# EAGLE design Motherboard_v2 (EAGLE 6.2)
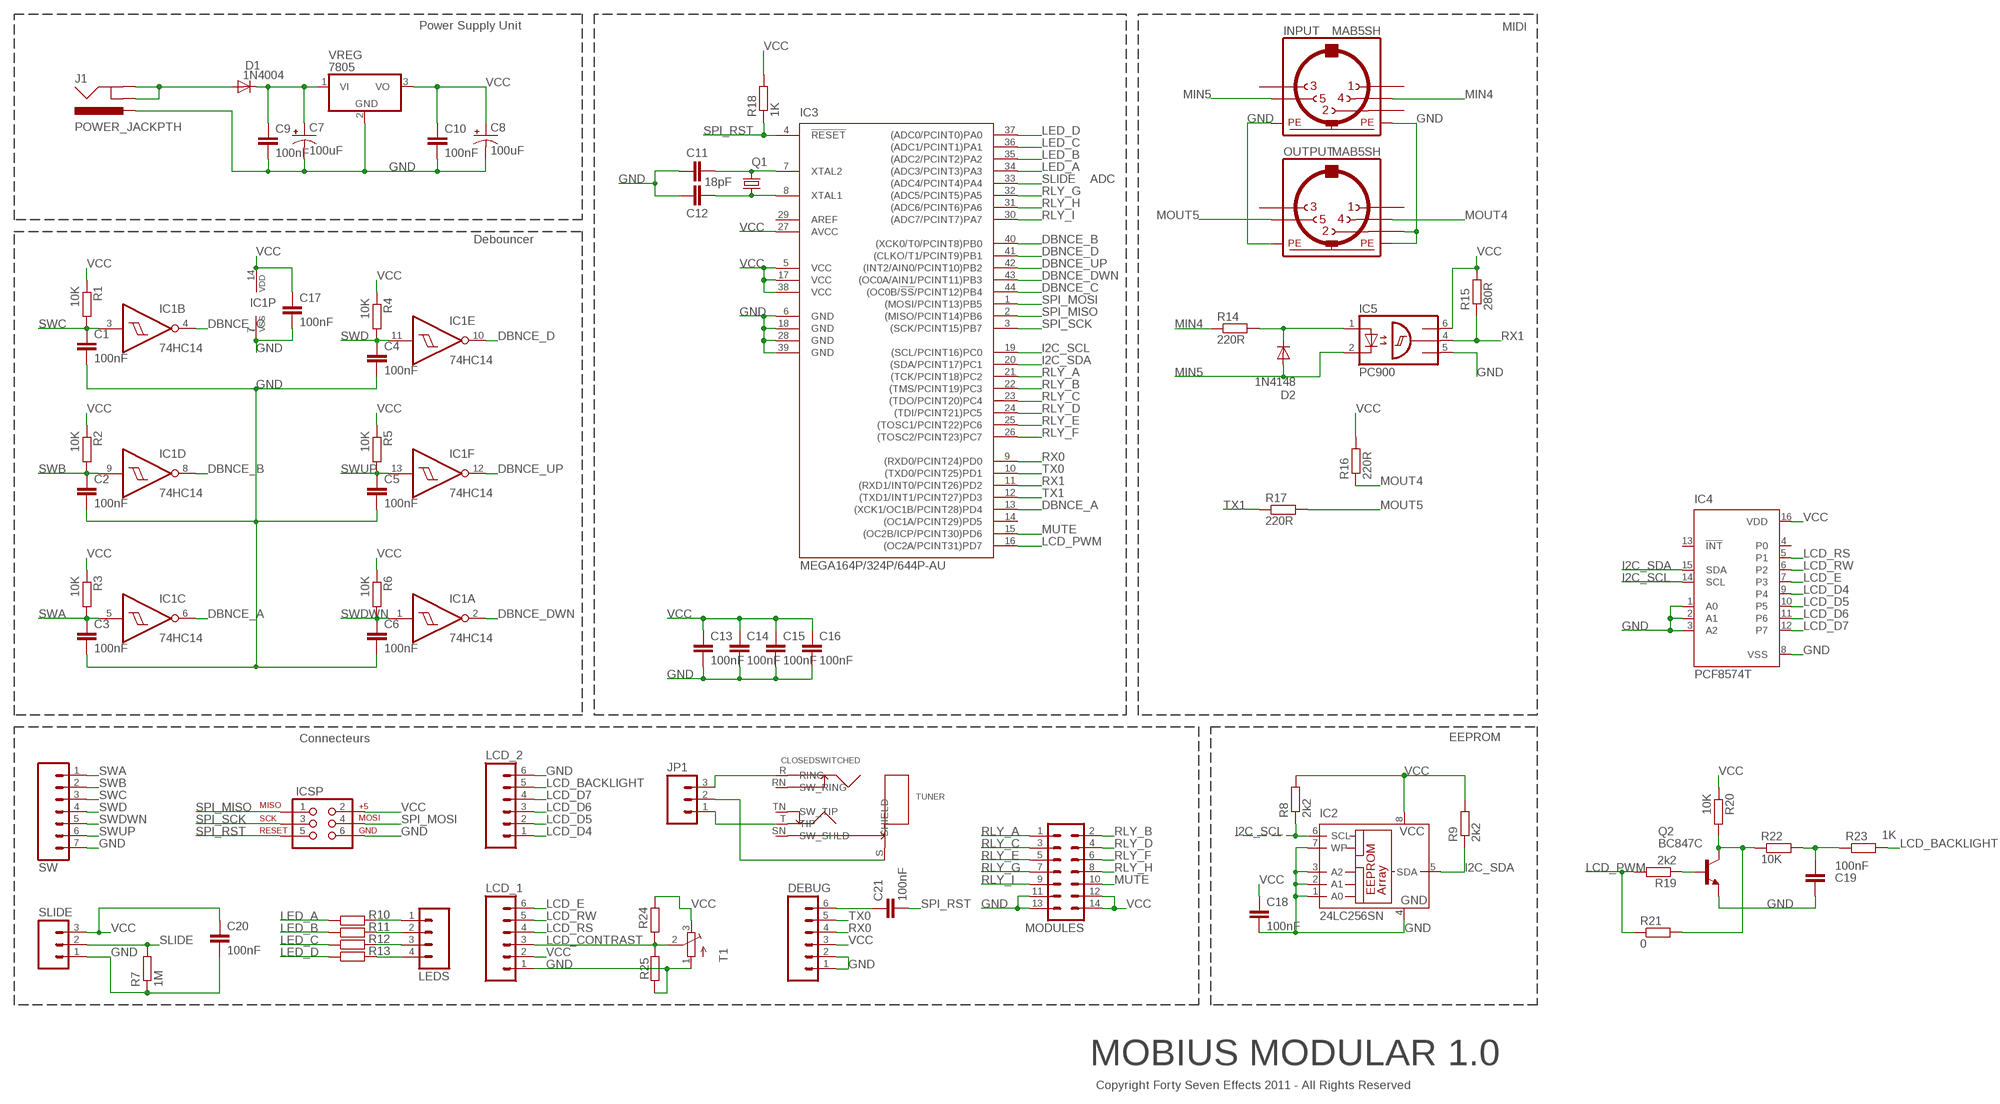
[diagram p0: schematic, sheet 1]

## Parts
C1  100nF  C-EUC0805K  [C0805K]
C2  100nF  C-EUC0805K  [C0805K]
C3  100nF  C-EUC0805K  [C0805K]
C4  100nF  C-EUC0805K  [C0805K]
C5  100nF  C-EUC0805K  [C0805K]
C6  100nF  C-EUC0805K  [C0805K]
C7  100uF  CPOL-USE2,5-6E  [E2,5-6E]
C8  100uF  CPOL-USE2,5-6E  [E2,5-6E]
C9  100nF  C-EUC0805K  [C0805K]
C10  100nF  C-EUC0805K  [C0805K]
C11  18pF  C-EUC0805K  [C0805K]
C12  18pF  C-EUC0805K  [C0805K]
C13  100nF  C-EUC0805K  [C0805K]
C14  100nF  C-EUC0805K  [C0805K]
C15  100nF  C-EUC0805K  [C0805K]
C16  100nF  C-EUC0805K  [C0805K]
C17  100nF  C-EUC0805K  [C0805K]
C18  100nF  C-EUC0805K  [C0805K]
C19  100nF  C-EUC0805K  [C0805K]
C20  100nF  C-EUC0805K  [C0805K]
C21  100nF  C-EUC0805K  [C0805K]
D1  1N4004  [DO41-10]
D2  1N4148  1N4148DO35-7  [DO35-7]
DEBUG  M06SIP  [1X06]
IC1  74HC14  40106D  [SO14]
IC2  24LC256SN  [SO-08]
IC3  MEGA164P/324P/644P-AU  [TQFP44]
IC4  PCF8574T  [SO16W]
IC5  PC900  OPI8013  [DIL06]
ICSP  AVR_SPI_PRG_6PTH  [2X3]
INPUT  MAB5SH  [MAB5SH]
J1  POWER_JACKPTH  [POWER_JACK_PTH]
JP1  M03POLAR  [MOLEX-1X3]
LCD_1  M06SIP  [1X06]
LCD_2  M06SIP  [1X06]
LEDS  M04PTH  [1X04]
MODULES  ML14  [ML14]
OUTPUT  MAB5SH  [MAB5SH]
Q1  16MHz  CRYSTAL5X3  [CRYSTAL-SMD-5X3]
Q2  BC847C  BC847CSMD  [SOT23]
R1  10K  R-EU_M0805  [M0805]
R2  10K  R-EU_M0805  [M0805]
R3  10K  R-EU_M0805  [M0805]
R4  10K  R-EU_M0805  [M0805]
R5  10K  R-EU_M0805  [M0805]
R6  10K  R-EU_M0805  [M0805]
R7  1M  R-EU_M0805  [M0805]
R8  2k2  R-EU_M0805  [M0805]
R9  2k2  R-EU_M0805  [M0805]
R10  1k  R-EU_M0805  [M0805]
R11  1K  R-EU_M0805  [M0805]
R12  1k  R-EU_M0805  [M0805]
R13  1k  R-EU_M0805  [M0805]
R14  220R  R-EU_M0805  [M0805]
R15  280R  R-EU_M0805  [M0805]
R16  220R  R-EU_M0805  [M0805]
R17  220R  R-EU_M0805  [M0805]
R18  1K  R-EU_M0805  [M0805]
R19  2k2  R-EU_M0805  [M0805]
R20  10K  R-EU_M0805  [M0805]
R21  0  R-EU_M0805  [M0805]
R22  10K  R-EU_M0805  [M0805]
R23  1K  R-EU_M0805  [M0805]
R24  1k  R-EU_M0805  [M0805]
R25  1k  R-EU_M0805  [M0805]
SLIDE  M03PTH  [1X03]
SW  M07  [1X07]
T1  TRIMPOTTC33X  [TC33X]
TUNER  CLOSEDSWITCHED  [NMJ6HFD2]
VREG  7805  7805TV  [TO220V]

## Nets
DBNCE_A: IC1.6(C:O) IC3.13((XCK1/OC1B/PCINT28)PD4)
DBNCE_B: IC1.8(D:O) IC3.40((XCK0/T0/PCINT8)PB0)
DBNCE_C: IC1.4(B:O) IC3.44((OC0B/!SS!/PCINT12)PB4)
DBNCE_D: IC1.10(E:O) IC3.41((CLKO/T1/PCINT9)PB1)
DBNCE_DWN: IC1.2(A:O) IC3.43((OC0A/AIN1/PCINT11)PB3)
DBNCE_UP: IC1.12(F:O) IC3.42((INT2/AIN0/PCINT10)PB2)
GND: C1.2 C2.2 C3.2 C4.2 C5.2 C6.2 C7.- C8.- C9.2 C10.2 C11.1 C12.1 C13.2 C14.2 C15.2 C16.2 C17.2 C18.2 C19.1 C20.2 DEBUG.1 DEBUG.2 IC1.7(P:VSS) IC2.1(A0) IC2.2(A1) IC2.3(A2) IC2.4(GND) IC2.7(WP) IC3.6(GND) IC3.18(GND) IC3.28(GND) IC3.39(GND) IC4.1(A0) IC4.2(A1) IC4.3(A2) IC4.8(VSS) IC5.5(GND) ICSP.6 INPUT.PE INPUT.PE@(PE) J1.PWR LCD_1.1 LCD_2.6 MODULES.11 MODULES.13 OUTPUT.2 OUTPUT.PE OUTPUT.PE@(PE) Q2.2(E) R7.1 R25.1 SLIDE.1 SW.7 T1.1(A) VREG.2(GND)
I2C_SCL: IC2.6(SCL) IC3.19((SCL/PCINT16)PC0) IC4.14(SCL) R8.1
I2C_SDA: IC2.5(SDA) IC3.20((SDA/PCINT17)PC1) IC4.15(SDA) R9.1
LCD_BACKLIGHT: LCD_2.5 R23.2
LCD_CONTRAST: LCD_1.3 R24.1 R25.2 T1.2(S)
LCD_D4: IC4.9(P4) LCD_2.1
LCD_D5: IC4.10(P5) LCD_2.2
LCD_D6: IC4.11(P6) LCD_2.3
LCD_D7: IC4.12(P7) LCD_2.4
LCD_E: IC4.7(P3) LCD_1.6
LCD_PWM: IC3.16((OC2A/PCINT31)PD7) R19.2 R21.1
LCD_RS: IC4.5(P1) LCD_1.4
LCD_RW: IC4.6(P2) LCD_1.5
LED_A: IC3.34((ADC3/PCINT3)PA3) R10.1
LED_B: IC3.35((ADC2/PCINT2)PA2) R11.1
LED_C: IC3.36((ADC1/PCINT1)PA1) R12.1
LED_D: IC3.37((ADC0/PCINT0)PA0) R13.1
MIN4: INPUT.4 R14.1
MIN5: D2.A IC5.2(C) INPUT.5
MOUT4: OUTPUT.4 R16.1
MOUT5: OUTPUT.5 R17.2
MUTE: IC3.15((OC2B/ICP/PCINT30)PD6) MODULES.10
N$1: C7.+ C9.1 D1.C VREG.1(VI)
N$2: LEDS.1 R10.2
N$3: LEDS.2 R11.2
N$4: D1.A J1.GND J1.GNDBREAK
N$5: LEDS.3 R12.2
N$6: D2.C IC5.1(A) R14.2
N$7: LEDS.4 R13.2
N$8: C11.2 IC3.7(XTAL2) Q1.3
N$9: C12.2 IC3.8(XTAL1) Q1.1
N$10: JP1.1 TUNER.T(TIP)
N$11: JP1.3 TUNER.R(RING)
N$12: JP1.2 TUNER.S(SHIELD)
N$13: Q2.1(B) R19.1
N$14: Q2.3(C) R20.2 R21.2 R22.1
N$15: C19.2 R22.2 R23.1
N$16: C21.1 DEBUG.6
RLY_A: IC3.21((TCK/PCINT18)PC2) MODULES.1
RLY_B: IC3.22((TMS/PCINT19)PC3) MODULES.2
RLY_C: IC3.23((TDO/PCINT20)PC4) MODULES.3
RLY_D: IC3.24((TDI/PCINT21)PC5) MODULES.4
RLY_E: IC3.25((TOSC1/PCINT22)PC6) MODULES.5
RLY_F: IC3.26((TOSC2/PCINT23)PC7) MODULES.6
RLY_G: IC3.32((ADC5/PCINT5)PA5) MODULES.7
RLY_H: IC3.31((ADC6/PCINT6)PA6) MODULES.8
RLY_I: IC3.30((ADC7/PCINT7)PA7) MODULES.9
RX0: DEBUG.4 IC3.9((RXD0/PCINT24)PD0)
RX1: IC3.11((RXD1/INT0/PCINT26)PD2) IC5.4(OUT) R15.1
SLIDE: IC3.33((ADC4/PCINT4)PA4) R7.2 SLIDE.2
SPI_MISO: IC3.2((MISO/PCINT14)PB6) ICSP.1
SPI_MOSI: IC3.1((MOSI/PCINT13)PB5) ICSP.4
SPI_RST: C21.2 IC3.4(!RESET) ICSP.5 R18.1
SPI_SCK: IC3.3((SCK/PCINT15)PB7) ICSP.3
SWA: C3.1 IC1.5(C:I) R3.2 SW.1
SWB: C2.1 IC1.9(D:I) R2.2 SW.2
SWC: C1.1 IC1.3(B:I) R1.2 SW.3
SWD: C4.1 IC1.11(E:I) R4.2 SW.4
SWDWN: C6.1 IC1.1(A:I) R6.2 SW.5
SWUP: C5.1 IC1.13(F:I) R5.2 SW.6
TX0: DEBUG.5 IC3.10((TXD0/PCINT25)PD1)
TX1: IC3.12((TXD1/INT1/PCINT27)PD3) R17.1
VCC: C8.+ C10.1 C13.1 C14.1 C15.1 C16.1 C17.1 C18.1 C20.1 DEBUG.3 IC1.14(P:VDD) IC2.8(VCC) IC3.5(VCC) IC3.17(VCC) IC3.27(AVCC) IC3.38(VCC) IC4.16(VDD) IC5.6(VCC) ICSP.2 LCD_1.2 MODULES.12 MODULES.14 R1.1 R2.1 R3.1 R4.1 R5.1 R6.1 R8.2 R9.2 R15.2 R16.2 R18.2 R20.1 R24.2 SLIDE.3 T1.3(E) VREG.3(VO)
Unconnected: IC3.14((OC1A/PCINT29)PD5) IC4.4(P0) IC4.13(!INT) INPUT.1 INPUT.2 INPUT.3 OUTPUT.1 OUTPUT.3 TUNER.RN(SW_RING) TUNER.SN(SW_SHLD) TUNER.TN(SW_TIP)

## Notes on the sheet
- Power Supply Unit | MIDI
- ADC
- Debouncer
- Connecteurs | EEPROM
- MOBIUS MODULAR 1.0
- Copyright Forty Seven Effects 2011 - All Rights Reserved

## Power pins joined to a net without a drawn wire
AREF: IC3.29(AREF)

## Library data of the parts
C1-C6 C9-C21 = rcl:C-EU: CAPACITOR, European symbol
C7 C8 = rcl:CPOL-US: POLARIZED CAPACITOR, American symbol
D1 = diode:1N4004: DIODE general purpose rectifier, 1 A
D2 = diode:1N4148: DIODE high speed (Philips)
DEBUG LCD_1 LCD_2 = SparkFun:M06: Header 6 Standard 6-pin 0.1" header. Use with straight break away headers (SKU : PRT-00116), right angle break away headers (PRT-00553), swiss pins (PRT-00743), machine pins (PRT-00117), and female headers (PRT-00115). Molex polarized connector foot print use with SKU : PRT-08094 with associated crimp pins and housings. NOTES ON THE VARIANTS LOCK and LOCK_LONGPADS... This footprint was designed to help hold the alignment of a through-hole component (i.e. 6-pin header) while soldering it into place. You may notice that each hole has been shifted either up or down by 0.005 of an inch from it's more standard position (which is a perfectly straight line). This slight alteration caused the pins (the squares in the middle) to touch the edges of the holes. Because they are alternating, it causes a "brace" to hold the component in place. 0.005 has proven to be the perfect amount of "off-center" position when using our standard breakaway headers. Although looks a little odd when you look at the bare footprint, once you have a header in there, the alteration is very hard to notice. Also, if you push a header all the way into place, it is covered up entirely on the bottom side. This idea of altering the position of holes to aid alignment will be further integrated into the Sparkfun Library for other footprints. It can help hold any component with 3 or more connection pins.
IC1 = 40xx:40106: Hex SCHMITT TRIGGER
IC2 = microchip:24*: Serial EEPROM I2C
IC3 = avr-5:MEGA164P/324P/644P-AU
IC4 = micro-philips:PCF8574: I2C-Bus Remote 8-bit I/O expander http://www.semiconductors.philips.com/acrobat_download/datasheets/PCF8574_4.pdf; MPN: PCF8574T/3,512; OC_FARNELL: 1201255; OC_NEWARK: 70R6870
IC5 = optocoupler:OPI8013: OPTO COUPLER
ICSP = SparkFun:AVR_SPI_PRG_6: AVR ISP 6 Pin This is the reduced ISP connector for AVR programming. Common on Arduino. This footprint will take up less PCB space and can be used with a 10-pin to 6-pin adapter such as SKU: BOB-08508
INPUT OUTPUT = con-hirschmann:MAB5SH: Female CONNECTOR 5 pins 90 deg. with shield, horizontal (DIN 41524); OC_FARNELL: 809883; OC_NEWARK: unknown
J1 = SparkFun:POWER_JACK: Power Jack This is the standard 5.5mm barrel jack for power. The PTH is the most common, proven, reliable, footprint. All others are experimental. The Slot footprint only works if the mill layer is transmitted to the PCB fab house so be warned. Spark Fun Electronics SKU : PRT-00119. Mating wall wart : TOL-00298 (and others)
JP1 SLIDE = SparkFun:M03: Header 3 Standard 3-pin 0.1" header. Use with straight break away headers (SKU : PRT-00116), right angle break away headers (PRT-00553), swiss pins (PRT-00743), machine pins (PRT-00117), and female headers (PRT-00115). Molex polarized connector foot print use with SKU : PRT-08232 with associated crimp pins and housings.
LEDS = SparkFun:M04: Header 4 Standard 4-pin 0.1" header. Use with straight break away headers (SKU : PRT-00116), right angle break away headers (PRT-00553), swiss pins (PRT-00743), machine pins (PRT-00117), and female headers (PRT-00115). Molex polarized connector foot print use with SKU : PRT-08231 with associated crimp pins and housings.
MODULES = con-harting-ml:ML14: HARTING
Q1 = SparkFun:CRYSTAL: Crystals Various standard crystals. Proven footprints. Spark Fun Electronics SKU : COM-00534
Q2 = transistor-npn:BC847*: NPN Transistor
R1-R25 = rcl:R-EU_: RESISTOR, European symbol
SW = SparkFun:M07: Header 7 Standard 7-pin 0.1" header. Use with straight break away headers (SKU : PRT-00116), right angle break away headers (PRT-00553), swiss pins (PRT-00743), machine pins (PRT-00117), and female headers (PRT-00115). NOTES ON THE VARIANTS LOCK and LOCK_LONGPADS... This footprint was designed to help hold the alignment of a through-hole component (i.e. 7-pin header) while soldering it into place. You may notice that each hole has been shifted either up or down by 0.005 of an inch from it's more standard position (which is usually a perfectly straight line). This slight alteration caused the pins (the squares in the middle) to touch the edges of the holes. Because they are alternating, it causes a "brace" to hold the header in place. 0.005 has proven to be the perfect amount of "off-center" position when using our standard breakaway headers. Although looks a little odd when you look at the bare footprint, once you have a header in there, the alteration is very hard to notice. Also, if you push a header all the way into place, it is covered up entirely on the bottom side. This idea of altering the position of holes to aid alignment will be further integrated into the Sparkfun Library for other footprints. It can help hold any component with 3 or more connection pins.
T1 = adafruit:TRIMPOT: SMT trimmer potentiometer part number TC33X http://www.ladyada.net/library/eagle
TUNER = NeutrikJack:CLOSEDSWITCHED
VREG = linear:78*: Positive VOLTAGE REGULATOR Source: http://cache.national.com/ds/LM/LM78L05.pdf http://www.fairchildsemi.com/ds/LM/LM7805.pdf

## Board
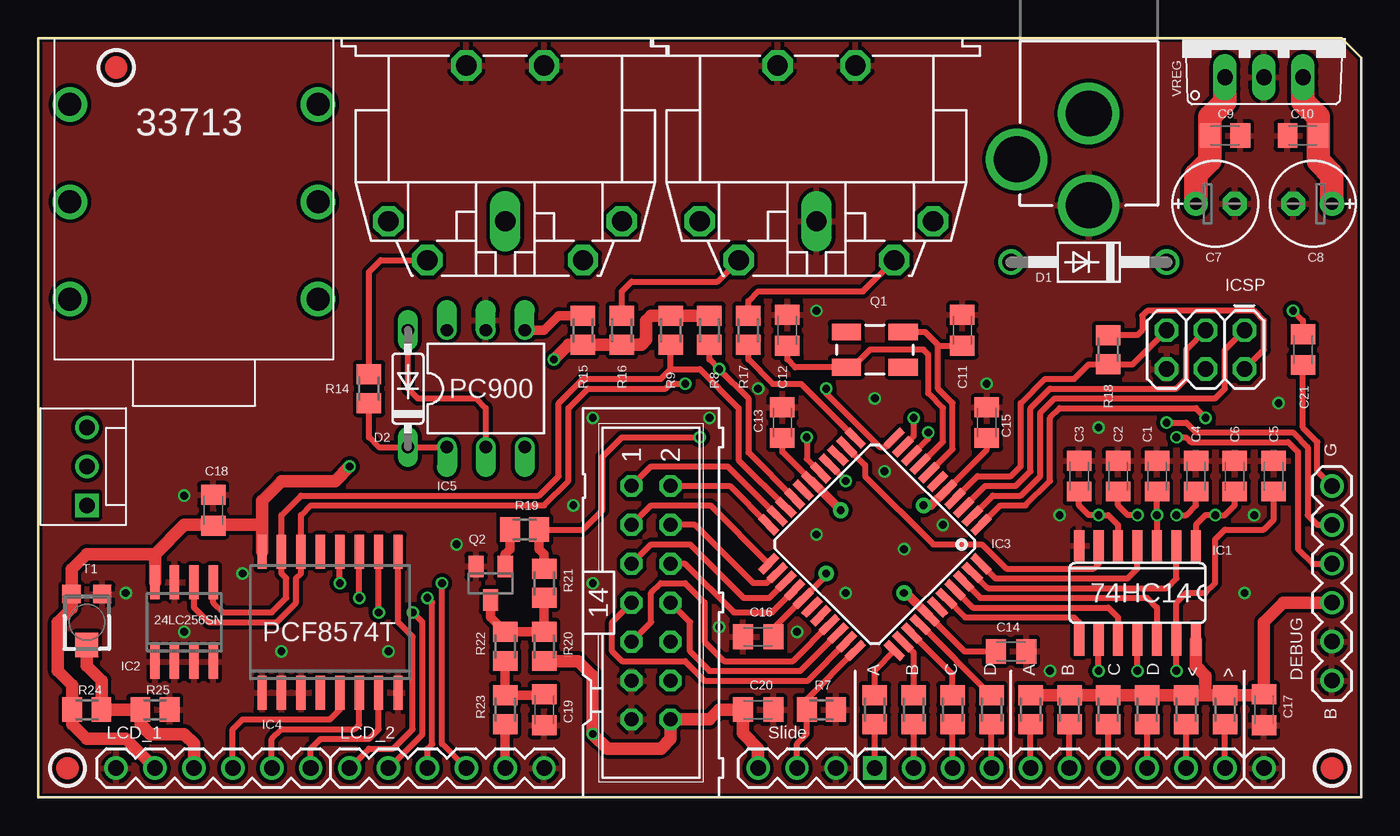
[diagram p1: board, top side]
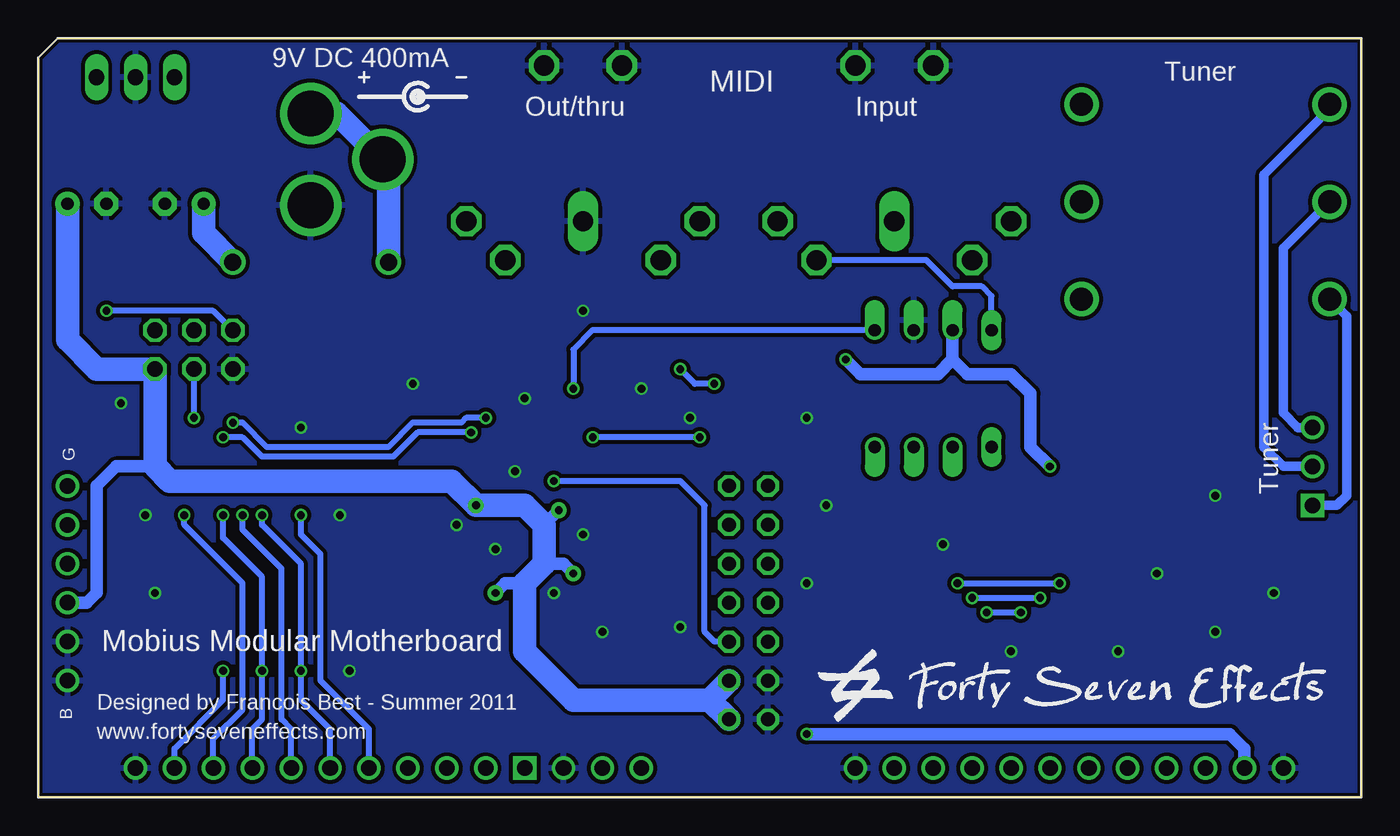
[diagram p2: board, bottom side, seen from below]

Size 86.36 x 49.53 mm. Coordinates in mm from the lower left corner, seen from the top.
Outline: 86.36,48.26 86.36,0 0,0 0,49.53 85.09,49.53 86.36,48.26
Copper layers (1*16): Top 0.035mm / dielectric 1.5mm / Bottom 0.035mm
Design rules: minimum track width 8mil, minimum drill 20mil, track to track 8mil, track to pad 8mil, pad to pad 8mil, via to via 8mil, smd to smd 0mil, copper to edge 10mil, drill to drill 10mil, minimum pad ring 10mil, minimum via ring 6mil, stop-mask expansion 2mil, vias tented up to drill 100mil, thermal gap 10mil

### Footprints (pad centres in the part's own frame; a part is rotated, then mirrored left to right if it is on the bottom)
C0805K = smd 1.3 x 1.6: 1 -1,0; 2 1,0
E2,5-6E = drill 0.813 pad 1.575: + -1.27,0 | drill 0.813 pad 1.575 octagon: - 1.27,0
DO41-10 = drill 1.118: A 5.08,0; C -5.08,0
DO35-7 = drill 0.813 long: A 3.81,0; C -3.81,0
1X06 = drill 1.016: 1 0,0; 2 2.54,0; 3 5.08,0; 4 7.62,0; 5 10.16,0; 6 12.7,0
SO14 = smd 0.66 x 2.032: 1 -3.81,-3.073; 2 -2.54,-3.073; 3 -1.27,-3.073; 4 0,-3.073; 5 1.27,-3.073; 6 2.54,-3.073; 7 3.81,-3.073; 8 3.81,3.073; 9 2.54,3.073; 10 1.27,3.073; 11 0,3.073; 12 -1.27,3.073; 13 -2.54,3.073; 14 -3.81,3.073
SO-08 = smd 0.6 x 2.2: 1 -1.905,-2.6; 2 -0.635,-2.6; 3 0.635,-2.6; 4 1.905,-2.6; 5 1.905,2.6; 6 0.635,2.6; 7 -0.635,2.6; 8 -1.905,2.6
TQFP44 = smd 1.5 x 0.5: 1 -5.8,4; 2 -5.8,3.2; 3 -5.8,2.4; 4 -5.8,1.6; 5 -5.8,0.8; 6 -5.8,0; 7 -5.8,-0.8; 8 -5.8,-1.6; 9 -5.8,-2.4; 10 -5.8,-3.2; 11 -5.8,-4; 23 5.8,-4; 24 5.8,-3.2; 25 5.8,-2.4; 26 5.8,-1.6; 27 5.8,-0.8; 28 5.8,0; 29 5.8,0.8; 30 5.8,1.6; 31 5.8,2.4; 32 5.8,3.2; 33 5.8,4 | smd 0.5 x 1.5: 12 -4,-5.8; 13 -3.2,-5.8; 14 -2.4,-5.8; 15 -1.6,-5.8; 16 -0.8,-5.8; 17 0,-5.8; 18 0.8,-5.8; 19 1.6,-5.8; 20 2.4,-5.8; 21 3.2,-5.8; 22 4,-5.8; 34 4,5.8; 35 3.2,5.8; 36 2.4,5.8; 37 1.6,5.8; 38 0.8,5.8; 39 0,5.8; 40 -0.8,5.8; 41 -1.6,5.8; 42 -2.4,5.8; 43 -3.2,5.8; 44 -4,5.8
SO16W = smd 0.6 x 2.2: 1 -4.445,-4.6; 2 -3.175,-4.6; 3 -1.905,-4.6; 4 -0.635,-4.6; 5 0.635,-4.6; 6 1.905,-4.6; 7 3.175,-4.6; 8 4.445,-4.6; 9 4.445,4.6; 10 3.175,4.6; 11 1.905,4.6; 12 0.635,4.6; 13 -0.635,4.6; 14 -1.905,4.6; 15 -3.175,4.6; 16 -4.445,4.6
DIL06 = drill 0.813 offset: 1 -2.54,-3.81; 2 0,-3.81; 3 2.54,-3.81; 4 2.54,3.81; 5 0,3.81; 6 -2.54,3.81
2X3 = drill 1.016 octagon: 1 0,0; 2 0,2.54; 3 2.54,0; 4 2.54,2.54; 5 5.08,0; 6 5.08,2.54
MAB5SH = drill 1.321 octagon: 1 7.62,5.08; 3 -7.62,5.08; 4 5.08,7.62; 5 -5.08,7.62; PE -2.54,-5.08; PE@ 2.54,-5.08 | drill 1.321 long: 2 0,5.08
POWER_JACK_PTH = drill 2.997: GND 0,7.7; GNDBREAK 4.7,10.7; PWR 0,13.7
MOLEX-1X3 = drill 1.016 square: 1 0,0 | drill 1.016: 2 2.54,0; 3 5.08,0
1X04 = drill 1.016 square: 1 0,0 | drill 1.016: 2 2.54,0; 3 5.08,0; 4 7.62,0
ML14 = drill 0.914 octagon: 1 -7.62,-1.27; 2 -7.62,1.27; 3 -5.08,-1.27; 4 -5.08,1.27; 5 -2.54,-1.27; 6 -2.54,1.27; 7 0,-1.27; 8 0,1.27; 9 2.54,-1.27; 10 2.54,1.27; 11 5.08,-1.27; 12 5.08,1.27; 13 7.62,-1.27; 14 7.62,1.27
CRYSTAL-SMD-5X3 = smd 1.9 x 1.1: 1 -1.85,-1.15; 2 1.85,-1.15; 3 1.85,1.15; 4 -1.85,1.15
SOT23 = smd 1 x 1.4: 1 -0.95,-1.1; 2 0.95,-1.1; 3 0,1.1
M0805 = smd 1.3 x 1.6: 1 -0.95,0; 2 0.95,0
1X03 = drill 1.016: 1 0,0; 2 2.54,0; 3 5.08,0
1X07 = drill 1.016: 1 0,0; 2 2.54,0; 3 5.08,0; 4 7.62,0; 5 10.16,0; 6 12.7,0; 7 15.24,0
TC33X = smd 1.2 x 1.2: 1 -1,-1.825; 3 1,-1.825 | smd 1.5 x 1.6: 2 0,1.5
NMJ6HFD2 = drill 1.5: R -8.1,0; RN 8.1,0; S -8.1,6.35; SN 8.1,6.35; T -8.1,-6.35; TN 8.1,-6.35
TO220V = drill 1.016 long: 1 -2.54,-2.54; 2 0,-2.54; 3 2.54,-2.54

### Placement (x,y rotation side)
C1  73.02,20.96 90 top
C2  70.48,20.96 90 top
C3  67.94,20.96 90 top
C4  75.56,20.96 90 top
C5  80.64,20.96 90 top
C6  78.11,20.96 90 top
C7  76.83,38.73 0 top
C8  83.19,38.73 180 top
C9  77.47,43.18 0 top
C10  82.55,43.18 180 top
C11  60.33,30.48 270 top
C12  48.89,30.48 270 top
C13  48.58,24.45 90 top
C14  63.5,9.53 0 top
C15  61.91,24.45 90 top
C16  46.99,10.48 180 top
C17  80.01,5.71 270 top
C18  11.43,18.73 90 top
C19  33.02,5.71 90 top
C20  46.99,5.71 0 top
C21  82.55,29.21 90 top
D1  68.58,34.92 180 top
D2  24.13,26.67 90 top
DEBUG  84.45,7.62 90 top
IC1  71.75,13.33 180 top
IC2  9.53,11.43 0 top
IC3  54.61,16.51 225 top
IC4  19.05,11.43 0 top
IC5  29.21,26.67 0 top
ICSP  78.74,30.48 180 top
INPUT  30.48,42.67 180 top
J1  68.58,52.32 180 top
JP1  3.18,19.05 90 top
LCD_1  5.08,1.9 0 top
LCD_2  20.32,1.9 0 top
LEDS  54.61,1.9 0 top
MODULES  40,12.7 270 top
OUTPUT  50.8,42.67 180 top
Q1  54.61,29.21 0 top
Q2  29.53,13.97 180 top
R1  69.85,5.71 270 top
R2  67.31,5.71 270 top
R3  64.77,5.71 270 top
R4  72.39,5.71 270 top
R5  77.47,5.71 270 top
R6  74.93,5.71 270 top
R7  51.12,5.71 180 top
R8  43.81,30.48 90 top
R9  41.28,30.48 90 top
R10  54.61,5.71 270 top
R11  57.15,5.71 270 top
R12  59.69,5.71 270 top
R13  62.23,5.71 270 top
R14  21.59,26.67 270 top
R15  35.56,30.48 270 top
R16  38.1,30.48 270 top
R17  46.36,30.48 90 top
R18  69.85,29.21 90 top
R19  31.75,17.46 0 top
R20  33.02,9.84 90 top
R21  33.02,13.97 270 top
R22  30.48,9.84 270 top
R23  30.48,5.71 270 top
R24  3.18,5.71 180 top
R25  7.62,5.71 180 top
SLIDE  52.07,1.9 180 top
SW  64.77,1.9 0 top
T1  3.18,11.43 180 top
TUNER  10.16,38.86 0 top
U$1  [FSE-LOGOTITLE]  35.56,4.76 0 bottom
VREG  80.01,49.53 0 top

### Tracks (layer width: path | path; a pad name or v marks a point on that pad's centre or on a via)
DBNCE_A
  Top 0.406: IC3.13 53.97,21.67 53.97,20.96 58.42,16.51 61.59,16.51 63.18,14.92 68.9,14.92 69.22,15.24 IC1.6
DBNCE_B
  Top 0.406: IC1.8 67.94,11.43 67.63,11.75 60.5,11.75 IC3.40
DBNCE_C
  Top 0.406: IC3.44 62.49,14.29 71.12,14.29 71.75,14.92 IC1.4
DBNCE_D
  Top 0.406: IC3.41 61,12.38 69.85,12.38 70.48,11.75 IC1.10
DBNCE_DWN
  Top 0.406: IC3.43 61.99,13.65 73.66,13.65 74.3,14.29 IC1.2
DBNCE_UP
  Top 0.406: IC3.42 61.5,13.02 72.39,13.02 73.02,12.38 IC1.12
GND  (via drill 0.51)
  other vias: 44.45,11.11 52.7,13.33 50.8,17.14 27.31,16.51 9.53,10.79 15.88,9.53 5.71,13.33 9.53,19.68 49.53,10.79 54.61,26.04 55.24,21.27 56.52,16.19 59.05,17.78 66.67,18.42 66.04,8.25 36.2,24.76 22.86,9.53 13.34,14.61 50.8,31.75 69.22,24.13 61.91,26.99 34.92,19.05 43.81,24.76 36.2,13.97 78.74,13.33 80.96,25.72 79.38,18.42 46.99,26.67
  pour Top (isolate 0.254): 0,49.53 85.09,49.53 86.36,48.26 86.36,0 0,0
  pour Bottom (isolate 0.254): 0,49.53 85.09,49.53 86.36,48.26 86.36,0 0,0
I2C_SCL  (via drill 0.51)
  Top 0.406: 49.42,19.48 IC3.19 46.36,22.5 46.36,26.04 v44.45,27.94 43.81,28.57 R8.1 | v42.23,26.99 41.28,26.99 40.96,26.67 35.88,26.67 34.61,25.4 34.61,20.64 33.02,19.05 17.78,19.05 17.14,18.42 IC4.14 17.14,14.61 16.83,14.29 16.83,12.7 15.56,11.43 11.11,11.43 10.16,12.38 IC2.6
  Bottom 0.406: v42.23,26.99 43.5,26.99 v44.45,27.94
I2C_SDA
  Top 0.406: IC3.20 45.72,22.01 45.72,25.4 43.18,27.94 41.28,27.94 | IC2.5 11.43,12.7 12.07,12.07 15.24,12.07 16.19,13.02 16.19,14.29 15.88,14.61 IC4.15 15.88,18.42 17.14,19.68 32.7,19.68 33.97,20.96 33.97,25.72 35.56,27.3 40.64,27.3 41.28,27.94 | 41.28,27.94 R9.1
LCD_BACKLIGHT
  Top 0.61: LCD_2.5 R23.2
LCD_CONTRAST
  Top 0.813: T1.2 3.18,8.57 4.13,7.62 R24.1 R25.2 6.67,4.76 7.3,4.13 9.53,4.13 10.16,3.49 LCD_1.3
LCD_D4
  Top 0.406: IC4.9 23.5,11.43 24.45,10.48 24.45,4.44 23.18,3.18 21.59,3.18 LCD_2.1
LCD_D5  (via drill 0.51)
  Top 0.406: v22.22,12.07 IC4.10 | v24.45,12.07 25.08,11.43 25.08,4.13 LCD_2.2
  Bottom 0.406: v24.45,12.07 v22.22,12.07
LCD_D6  (via drill 0.51)
  Top 0.406: v20.96,13.02 IC4.11 | v25.4,13.02 25.72,12.7 25.72,3.49 25.4,3.18 LCD_2.3
  Bottom 0.406: v25.4,13.02 v20.96,13.02
LCD_D7  (via drill 0.51)
  Top 0.406: v19.68,13.97 IC4.12 | v26.35,13.97 26.35,3.49 LCD_2.4
  Bottom 0.406: v26.35,13.97 v19.68,13.97
LCD_E
  Top 0.406: IC4.7 22.22,4.44 21.59,3.81 18.41,3.81 17.78,3.18 LCD_1.6
LCD_PWM  (via drill 0.51)
  Top 0.406: IC3.16 50.17,22.09 v50.17,23.5 | v43.18,23.5 38.1,23.5 36.83,22.22 36.83,18.73 35.56,17.46 R19.2
  Top 0.61: R19.2 32.7,16.19 33.02,15.87 R21.1
  Bottom 0.406: v43.18,23.5 v50.17,23.5
LCD_RS
  Top 0.406: IC4.5 19.68,5.71 19.05,5.08 13.34,5.08 12.7,4.44 LCD_1.4
LCD_RW
  Top 0.406: IC4.6 20.96,4.76 20.64,4.44 15.88,4.44 15.24,3.81 LCD_1.5
LED_A
  Top 0.406: R10.1 54.61,8.31 IC3.34
LED_B
  Top 0.406: R11.1 57.15,9.44 IC3.35
LED_C
  Top 0.406: R12.1 59.69,8.04 IC3.36
LED_D
  Top 0.406: R13.1 62.19,6.67 IC3.37
MIN4
  Top 0.406: INPUT.4 22.35,35.05 21.59,34.29 R14.1
MIN5
  Top 0.406: D2.A 24.13,26.67 24.77,26.04 28.57,26.04 29.21,25.4 IC5.2
  Bottom 0.406: INPUT.5 28.38,35.05 26.67,33.34 24.77,33.34 24.13,32.7 D2.A
MOUT4
  Top 0.406: R16.1 38.1,33.02 38.73,33.66 44.32,33.66 OUTPUT.4
MOUT5
  Top 0.406: OUTPUT.5 53.85,33.02 46.99,33.02 46.36,32.39 R17.2
MUTE  (via drill 0.51)
  Top 0.406: v52.7,20.64 52.7,20.68 IC3.15
  Bottom 0.406: MODULES.10 42.23,10.16 42.86,10.79 42.86,19.05 44.45,20.64 v52.7,20.64
N$1
  Top 1.524: VREG.1 77.47,45.4 76.47,44.4 C9.1 76.47,41.55 75.56,40.64 C7.+
  Bottom 1.524: D1.C 75.56,36.83 C7.+
N$2
  Top 0.406: LEDS.1 R10.2
N$3
  Top 0.406: LEDS.2 R11.2
N$4
  Bottom 1.524: D1.A 63.5,41.24 J1.GNDBREAK 66.88,44.62 J1.GND
N$5
  Top 0.406: LEDS.3 R12.2
N$6
  Top 0.406: IC5.1 D2.C 22.22,22.86 21.59,23.5 R14.2
N$7
  Top 0.406: LEDS.4 R13.2
N$8
  Top 0.406: IC3.7 59.69,22.72 59.69,25.72 58.74,26.67 58.74,29.53 | Q1.3 57.91,30.36 58.74,29.53 | C11.2 58.78,29.48 58.74,29.53
N$9
  Top 0.406: IC3.8 59.05,23.22 59.05,25.4 58.1,26.35 58.1,28.89 57.78,29.21 54.29,29.21 53.34,28.26 52.96,28.26 Q1.1 49.41,28.06 48.89,28.57 C12.2
N$10
  Bottom 0.61: JP1.1 1.59,19.05 0.95,19.68 0.95,31.4 TUNER.T
N$11
  Bottom 0.61: TUNER.R 5.08,35.84 5.08,25.08 4.13,24.13 JP1.3
N$12
  Bottom 0.61: TUNER.S 2.06,44.93 6.35,40.64 6.35,22.86 5.08,21.59 JP1.2
N$13
  Top 0.61: R19.1 30.8,16.19 30.48,15.87 Q2.1
N$14
  Top 0.61: Q2.3 29.53,11.75 R22.1 R20.2 R21.2
N$15
  Top 0.61: R22.2 R23.1 32.97,6.67 C19.2
N$16
  Top 0.406: DEBUG.6 83.5,21.27 83.5,23.18 82.55,24.13 C21.1
RLY_A
  Top 0.406: IC3.21 45,21.59 40,21.59 MODULES.1
RLY_B
  Top 0.406: IC3.22 45.14,20.32 MODULES.2
RLY_C
  Top 0.406: IC3.23 43.87,19.05 40,19.05 MODULES.3
RLY_D
  Top 0.406: IC3.24 47.55,13.97 46.67,13.97 42.86,17.78 MODULES.4
RLY_E
  Top 0.406: IC3.25 47.72,13.02 46.04,13.02 42.55,16.51 40,16.51 MODULES.5
RLY_F
  Top 0.406: IC3.26 47.9,12.07 45.4,12.07 42.23,15.24 MODULES.6
RLY_G
  Top 0.406: IC3.32 50.25,7.62 43.5,7.62 42.23,8.89 38.1,8.89 37.47,9.53 37.47,11.43 MODULES.7
RLY_H
  Top 0.406: IC3.31 49.75,8.25 43.81,8.25 42.55,9.53 42.55,11.43 MODULES.8
RLY_I
  Top 0.406: IC3.30 49.25,8.89 44.77,8.89 43.5,10.16 43.5,12.7 42.23,13.97 40.64,13.97 40,13.33 40,11.43 MODULES.9
RX0  (via drill 0.51)
  Top 0.406: v58.1,23.81 58.1,23.4 IC3.9 | v74.3,23.5 74.93,23.5 75.25,23.18 81.6,23.18 82.23,22.54 82.23,16.19 83.19,15.24 DEBUG.4
  Bottom 0.406: v58.1,23.81 61.59,23.81 63.18,22.22 71.75,22.22 73.02,23.5 v74.3,23.5
RX1  (via drill 0.51)
  Top 0.406: 55.83,23.44 IC3.11 55.3,22.86 54.93,22.86 51.44,26.35 v51.44,26.67
  Top 0.61: R15.1 33.97,31.43 33.02,30.48 IC5.4
  Bottom 0.406: v51.44,26.67 51.44,29.21 50.17,30.48 IC5.4
SLIDE
  Top 0.406: SLIDE.2 49.53,3.49 50.17,4.13 R7.2 50.17,6.41 IC3.33
SPI_MISO
  Top 0.406: IC3.2 62.31,19.68 64.13,19.68 65.41,20.96 65.41,25.08 66.36,26.04 76.83,26.04 77.47,26.67 77.47,29.21 ICSP.1
SPI_MOSI  (via drill 0.51)
  Top 0.406: IC3.1 62.81,19.05 64.45,19.05 66.04,20.64 66.04,24.76 66.67,25.4 75.56,25.4 v76.2,24.76
  Bottom 0.406: v76.2,24.76 ICSP.4
SPI_RST  (via drill 0.51)
  Top 0.406: IC3.4 61.32,20.96 63.5,20.96 64.13,21.59 64.13,25.72 65.72,27.3 67.63,27.3 68.58,28.26 R18.1 71.44,28.26 ICSP.5 | C21.2 82.55,31.11 v81.91,31.75
  Bottom 0.406: ICSP.5 74.93,31.75 v81.91,31.75
SPI_SCK
  Top 0.406: IC3.3 61.81,20.32 63.82,20.32 64.77,21.27 64.77,25.4 66.04,26.67 74.3,26.67 74.93,27.3 74.93,29.21 ICSP.3
SWA  (via drill 0.51)
  Top 0.406: SW.1 R3.2 | C3.1 67.94,19.05 68.58,18.42 v69.22,18.42 69.85,18.42 70.48,17.78 IC1.5
  Bottom 0.406: SW.1 64.77,4.44 67.94,7.62 67.94,15.87 69.22,17.14 v69.22,18.42
SWB  (via drill 0.51)
  Top 0.406: SW.2 R2.2 | C2.1 70.48,19.05 71.12,18.42 v71.75,18.42 | v69.22,8.25 IC1.9
  Bottom 0.406: SW.2 67.31,4.44 69.22,6.35 v69.22,8.25 69.22,15.24 71.75,17.78 v71.75,18.42
SWC  (via drill 0.51)
  Top 0.406: SW.3 R1.2 | C1.1 v73.02,18.42 IC1.3
  Bottom 0.406: SW.3 69.85,4.44 70.48,5.08 70.48,14.92 73.02,17.46 v73.02,18.42
SWD  (via drill 0.51)
  Top 0.406: SW.4 R4.2 | C4.1 75.56,19.05 74.93,18.42 v74.3,18.42 | v71.75,8.25 IC1.11
  Bottom 0.406: SW.4 72.39,4.45 71.75,5.08 v71.75,8.25 71.75,14.39 74.3,16.93 v74.3,18.42
SWDWN  (via drill 0.51)
  Top 0.406: SW.5 R6.2 | C6.1 78.11,19.05 77.47,18.42 v76.83,18.42 76.2,18.42 75.56,17.78 IC1.1
  Bottom 0.406: SW.5 74.93,3.81 73.02,5.71 73.02,13.97 76.83,17.78 v76.83,18.42
SWUP  (via drill 0.51)
  Top 0.406: SW.6 R5.2 | v74.3,8.25 IC1.13 74.3,12.7 74.93,13.33 76.2,13.33 76.83,13.97 76.83,16.83 77.47,17.46 80.01,17.46 80.64,18.1 C5.1
  Bottom 0.406: v74.3,8.25 74.3,6.35 77.47,3.18 SW.6
TX0  (via drill 0.51)
  Top 0.406: v57.15,24.76 57.15,23.58 IC3.10 | v73.66,24.45 74.93,24.45 75.56,23.81 81.91,23.81 82.87,22.86 82.87,18.42 83.5,17.78 DEBUG.5
  Bottom 0.406: v57.15,24.76 58.42,24.76 58.74,24.45 61.91,24.45 63.5,22.86 71.44,22.86 73.02,24.45 v73.66,24.45
TX1
  Top 0.406: R17.1 46.36,28.57 47.94,26.99 49.79,26.99 IC3.12
VCC  (via drill 0.51, 0.51 pad 1.02)
  Top 0.406: C14.1 60.46,9.53 IC3.38 | C13.1 48.58,22.54 50.96,20.16 | C15.1 61.91,22.68 IC3.5 | ICSP.2 80.01,29.21 80.01,31.11 79.38,31.75 72.39,31.75 72.07,31.43 72.07,30.48 71.75,30.16 R18.2 | 51.44,14.47 IC3.27 47.99,11.02 C16.1
  Top 0.61: v52.39,18.73 50.96,20.16 IC3.17 | v57.78,19.05 58.28,19.05 IC3.5 | v56.52,13.33 56.65,13.33 IC3.38 | v51.44,14.61 51.44,14.47
  Top 0.813: v33.66,28.57 34.61,29.53 R15.2 R16.2 39.37,29.53 39.69,29.85 39.69,31.11 40,31.43 R9.2 R8.2 | 7.62,15.87 IC2.8 | 14.61,17.78 IC4.16 | 7.62,15.87 9.53,17.78 11.43,17.78 | 11.43,17.78 14.61,17.78 | 11.43,17.78 C18.1 | SLIDE.3 46.99,3.18 45.99,4.18 C20.1 44.45,5.71 43.81,5.08 MODULES.14 41.28,3.81 40.64,3.18 37.15,3.18 v36.2,4.13 36.2,7.94 35.24,8.89 R20.1 | R3.1 R2.1 R1.1 R4.1 R6.1 76.2,6.67 | 76.2,6.67 R5.1 79.96,6.67 C17.1 80.01,11.43 81.28,12.7 DEBUG.3 | 76.2,6.67 76.2,7.94 75.56,8.57 IC1.14 | 7.62,15.87 3.18,15.87 2.18,14.87 T1.3 2.18,12.33 1.27,11.43 1.27,8.25 2.22,7.3 R24.2 2.23,4.76 3.18,3.81 5.71,3.81 LCD_1.2 | 14.61,17.78 14.61,19.37 15.88,20.64 19.37,20.64 v20.32,21.59
  Top 1.524: VREG.3 82.55,45.4 83.55,44.4 C10.1 83.55,41.55 84.45,40.64 C8.+
  Bottom 0.813: 53.34,17.78 v52.39,18.73 | 54.61,13.97 55.88,13.97 v56.52,13.33 | 53.34,15.24 52.07,15.24 v51.44,14.61 | v33.66,28.57 32.7,27.62 27.62,27.62 26.67,28.57 | v36.2,4.13 8.57,4.13 7.62,3.18 LCD_1.2 | 26.67,28.57 IC5.6 | 26.67,28.57 25.72,27.62 22.86,27.62 21.59,26.35 21.59,22.86 v20.32,21.59 | DEBUG.3 83.19,12.7 82.55,13.33 82.55,20.32 81.28,21.59 78.74,21.59
  Bottom 1.524: 42.55,6.35 51.44,6.35 54.61,9.53 54.61,13.97 53.34,15.24 53.34,17.78 54.61,19.05 v57.78,19.05 59.37,20.64 77.79,20.64 78.74,21.59 ICSP.2 82.55,27.94 84.45,29.85 C8.+ | 42.55,6.35 MODULES.12 | MODULES.14 42.55,6.35
(copper drawn outside any net)
  shapes: Top circle x3

### Text on the board
tPlace: 33713 | G | ^ | ^ | A | B | C | D | A | B | C | D | B
bPlace: 9V DC 400mA | Tuner | MIDI | Input | Out/thru | Tuner | G | Mobius Modular Motherboard | Designed by Francois Best - Summer 2011 | B | www.fortyseveneffects.com
tNames: Slide